# Altium schematic sheet Integrator.SchDoc
size A4; SheetNumber: 1; SheetTotal: 1
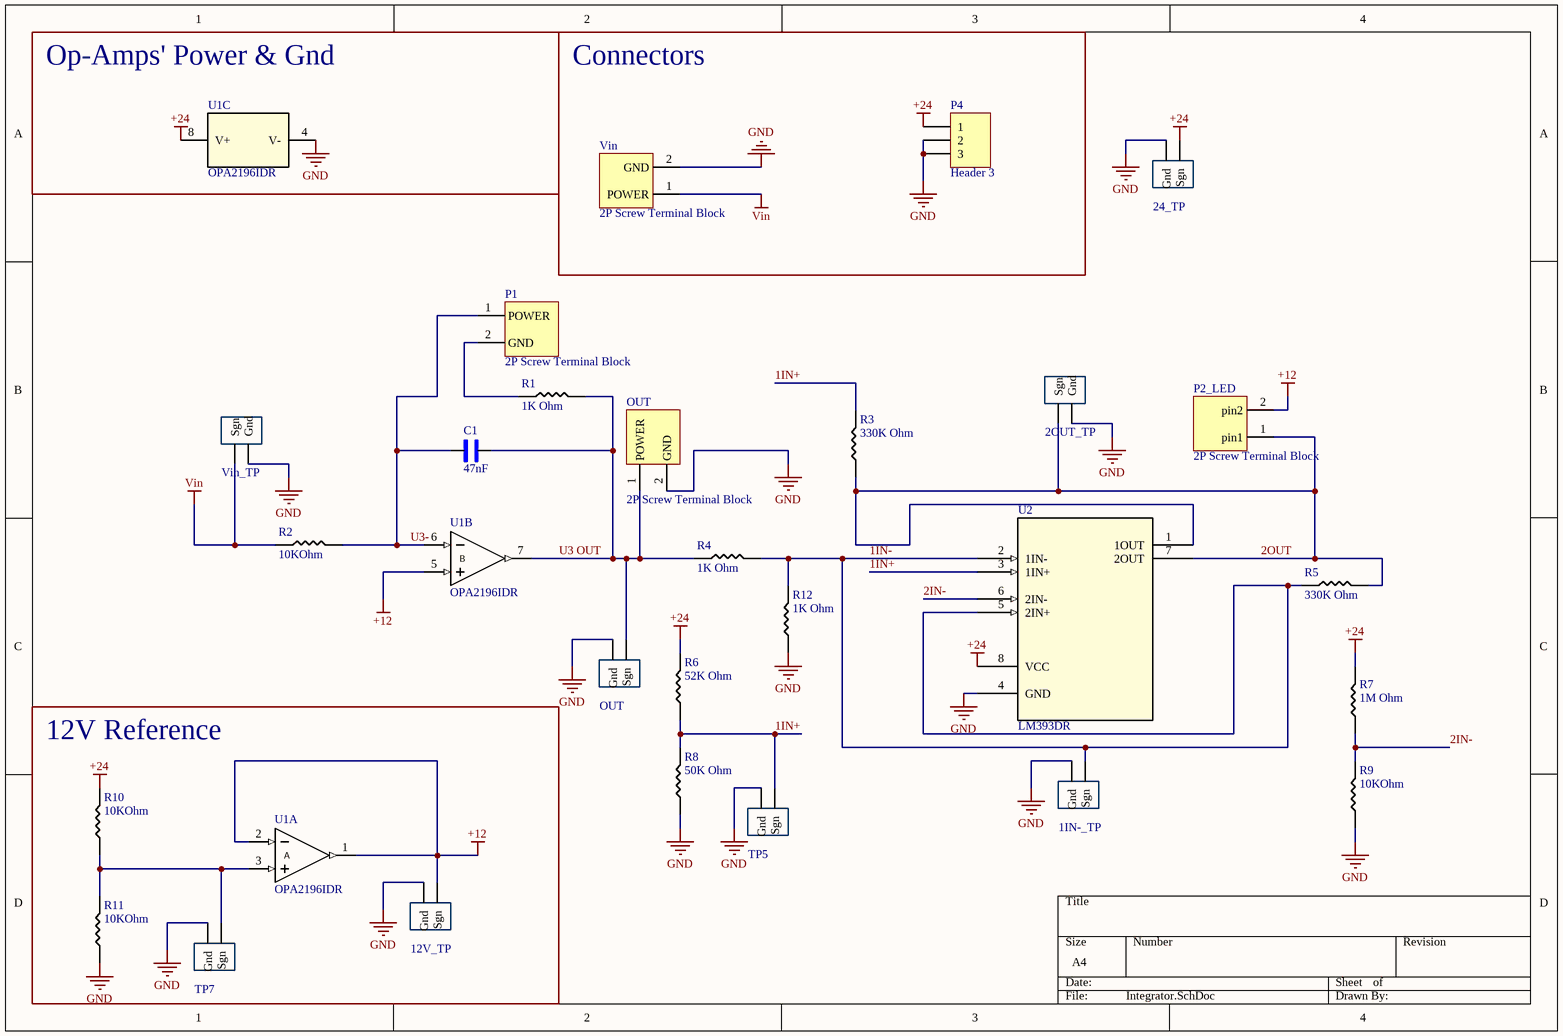
[diagram p0: Integrator.SchDoc]

## Parts
(Parts that share a designator on the sheet are numbered #1, #2 ... from top to bottom, then left to right.)
1IN-_TP  10x Probe TP  [TP10x_Probe]  (value not drawn)
2OUT_TP  10x Probe TP  [TP10x_Probe]  (value not drawn)
12V_TP  10x Probe TP  [TP10x_Probe]  (value not drawn)
24_TP  10x Probe TP  [TP10x_Probe]  (value not drawn)
C1  47nF  [1206_Passive_Capacitor]
OUT#1  2P Screw Terminal Block  [P_Terminal block 3.5mm-pitch]
OUT#2  10x Probe TP  [TP10x_Probe]  (value not drawn)
P1  2P Screw Terminal Block  [P_Terminal block 3.5mm-pitch]
P2_LED  2P Screw Terminal Block  [P_Terminal block 3.5mm-pitch]
P4  Header 3  [HDR1X3]
R1  value 1K Ohm  [1206_Passive_Resitor]  (hidden comment: 1k)
R2  value 10KOhm  [1206_Passive_Resitor]  (hidden comment: 10k)
R3  value 330K Ohm  [1206_Passive_Resitor]  (hidden comment: 1k)
R4  value 1K Ohm  [1206_Passive_Resitor]  (hidden comment: 1k)
R5  value 330K Ohm  [1206_Passive_Resitor]  (hidden comment: 1k)
R6  value 52K Ohm  [1206_Passive_Resitor]  (hidden comment: 52k)
R7  value 1M Ohm  [1206_Passive_Resitor]  (hidden comment: 1M)
R8  value 50K Ohm  [1206_Passive_Resitor]  (hidden comment: 1k)
R9  value 10KOhm  [1206_Passive_Resitor]  (hidden comment: 10k)
R10  value 10KOhm  [1206_Passive_Resitor]  (hidden comment: 10k)
R11  value 10KOhm  [1206_Passive_Resitor]  (hidden comment: 10k)
R12  value 1K Ohm  [1206_Passive_Resitor]  (hidden comment: 1k)
TP5  10x Probe TP  [TP10x_Probe]  (value not drawn)
TP7  10x Probe TP  [TP10x_Probe]  (value not drawn)
U1  OPA2196IDR  [D0008A_N]  (parts A,B,C of 3)
U2  LM393DR  [D8]
Vin  2P Screw Terminal Block  [P_Terminal block 3.5mm-pitch]
Vin_TP  10x Probe TP  [TP10x_Probe]  (value not drawn)

## Blocks framed on the sheet
Op-Amps' Power & Gnd: U1
Connectors: P4 Vin
12V Reference: 12V_TP R10 R11 TP7 U1

## Nets
+12: 12V_TP.1(Sgn) P2_LED.2(pin2) U1.1(OUT) U1.2(IN-) U1.5(IN+)
+24: 24_TP.1(Sgn) P4.1 R6.2 R7.2 R10.2 U1.8(V+) U2.8(VCC)
GND: 1IN-_TP.2(Gnd) 2OUT_TP.2(Gnd) 12V_TP.2(Gnd) 24_TP.2(Gnd) OUT#1.2(GND) OUT#2.2(Gnd) P4.2 P4.3 R8.1 R9.1 R11.1 R12.1 TP5.2(Gnd) TP7.2(Gnd) U1.4(V-) U2.4(GND) Vin.2(GND) Vin_TP.2(Gnd)
Vin: R2.1 Vin.1(POWER) Vin_TP.1(Sgn)
1IN+: R3.2 R6.1 R8.2 TP5.1(Sgn) U2.3(1IN+)
1IN-: 1IN-_TP.1(Sgn) R4.2 R5.1 R12.2 U2.2(1IN-) U2.5(2IN+)
2IN-: R7.1 R9.2 U2.6(2IN-)
2OUT: 2OUT_TP.1(Sgn) P2_LED.1(pin1) R3.1 R5.2 U2.1(1OUT) U2.7(2OUT)
U3 OUT: C1.2 OUT#1.1(POWER) OUT#2.1(Sgn) R1.2 R4.1 U1.7(OUT)
U3-: C1.1 P1.1(POWER) R2.2 U1.6(IN-)
NetP1_2: P1.2(GND) R1.1
NetR10_1: R10.1 R11.2 TP7.1(Sgn) U1.3(IN+)

## Notes on the sheet
- (in symbol OPA2196IDR, part A) A
- (in symbol OPA2196IDR, part B) B

## Library data of the parts
1IN-_TP 2OUT_TP 12V_TP 24_TP OUT#2 TP5 TP7 Vin_TP = TP_10x_Probe: Test Point 300 mil centers
C1 = C_47nF_1206: 47nF ±5% 50V C0G 1206 Multilayer Ceramic Capacitors MLCC - SMD/SMT RoHS; MFR Part #: GRM31M5C1H473JA01L; Type: Extended; LCSC Part#: C21812; Datasheet: https://datasheet.lcsc.com/lcsc/1810201313_Murata-Electronics-GRM31M5C1H473JA01L_C21812.pdf; Value: 47nF
OUT#1 P1 P2_LED Vin = P_Terminal block: Green Straight pin 3.5mm  pitch; P=3.5mm  Screw terminal ROHS; MFR Part #: KF350-3.5-2P; Manufacturer: Cixi Kefa Elec; LCSC Part#: C474892; DataSheet: https://datasheet.lcsc.com/lcsc/2001160007_Cixi-Kefa-Elec-KF350-3-5-2P_C474892.pdf
P4 = Header 3: Header, 3-Pin; LatestRevisionDate: 17-Jul-2002; LatestRevisionNote: Re-released for DXP Platform.; Publisher: Altium Limited
R1 R3-R5 R8 R12 = R_1K_1206: CHIP RESISTOR - SURFACE MOUNT 1KOHMS ±1% 1/4W 1206 ROHS; MFR Part #: RNCP1206FTD1K00CT; Digikey Link: https://www.digikey.com/product-detail/en/RNCP1206FTD1K00/RNCP1206FTD1K00CT-ND/2240675/?itemSeq=304982373; LCSC Part#: C4410; Type: Basic
R2 R9-R11 = R_10KOhm_1206: 10 kOhms ±5% 0.25W, 1/4W Chip Resistor 1206 (3216 Metric) Automotive AEC-Q200 Thick Film; MFR Part #: RMCF1206FT10K0; Digikey Link: https://www.digikey.com/en/products/detail/stackpole-electronics-inc/RMCF1206FT10K0/1759669; LCSC Part#: C17902; Type: Basic
R6 = R_1K_1206: CHIP RESISTOR - SURFACE MOUNT 52KOHMS ±1% 1/4W 1206 ROHS; MFR Part #: RNCP1206FTD1K00CT; Digikey Link: https://www.digikey.com/product-detail/en/RNCP1206FTD1K00/RNCP1206FTD1K00CT-ND/2240675/?itemSeq=304982373; LCSC Part#: C4410; Type: Basic
R7 = R_1M_1206: CHIP RESISTOR - SURFACE MOUNT 1MOHMS ±1% 1/4W 1206 ROHS; MFR Part #: RMCF1206JT1M00; Digikey Link: https://www.digikey.com/product-detail/en/RMCF1206JT1M00/RMCF1206JT1M00CT-ND/1942830/?itemSeq=304982358; LCSC Part#: C17927; Type: Basic
U1 = OPA2196IDR: Dual, 36-V, low power, all-purpose amplifier with mux-friendly input 8-SOIC -40 to 125; Manufacturer_Name: Texas Instruments; TYPE: TYPE; RefDes: RefDes; Copyright: Copyright (C) 2026 Ultra Librarian. All rights reserved.; Manufacturer_Part_Number: OPA2196IDR; Datasheet: https://www.ti.com/lit/gpn/opa2196
U2 = LM393DR: Dual differential comparator, commercial grade 8-SOIC 0 to 70; Manufacturer_Name: Texas Instruments; Copyright: Copyright (C) 2025 Ultra Librarian. All rights reserved.; Manufacturer_Part_Number: LM393DR; RefDes: RefDes; Type: Type